# Altium schematic sheet POWER.SchDoc
size A3; ApprovedBy: b; CheckedBy: a; CompanyName: 天津市松正电动汽车技术股份有限公司; DocumentNumber: SZQZ-YL-0035; SheetNumber: 2; SheetTotal: 5; PageSetup: Record=PageOptions|CenterHorizontal=True|CenterVertical=True|PrintScale=0.86|XCorrection=1.00|YCorrection=1.00|PrintKind=1|BorderSize=5000000|LeftOffset=0|BottomOffset=0|Orientation=2|PaperLength=1000|PaperWidth=1000|Scale=100|PaperSource=7|PrintQuality=-4|MediaType=1|DitherType=10|PaperKind=B4|PrintScaleMode=1; ModifiedDate: 2017-3-1
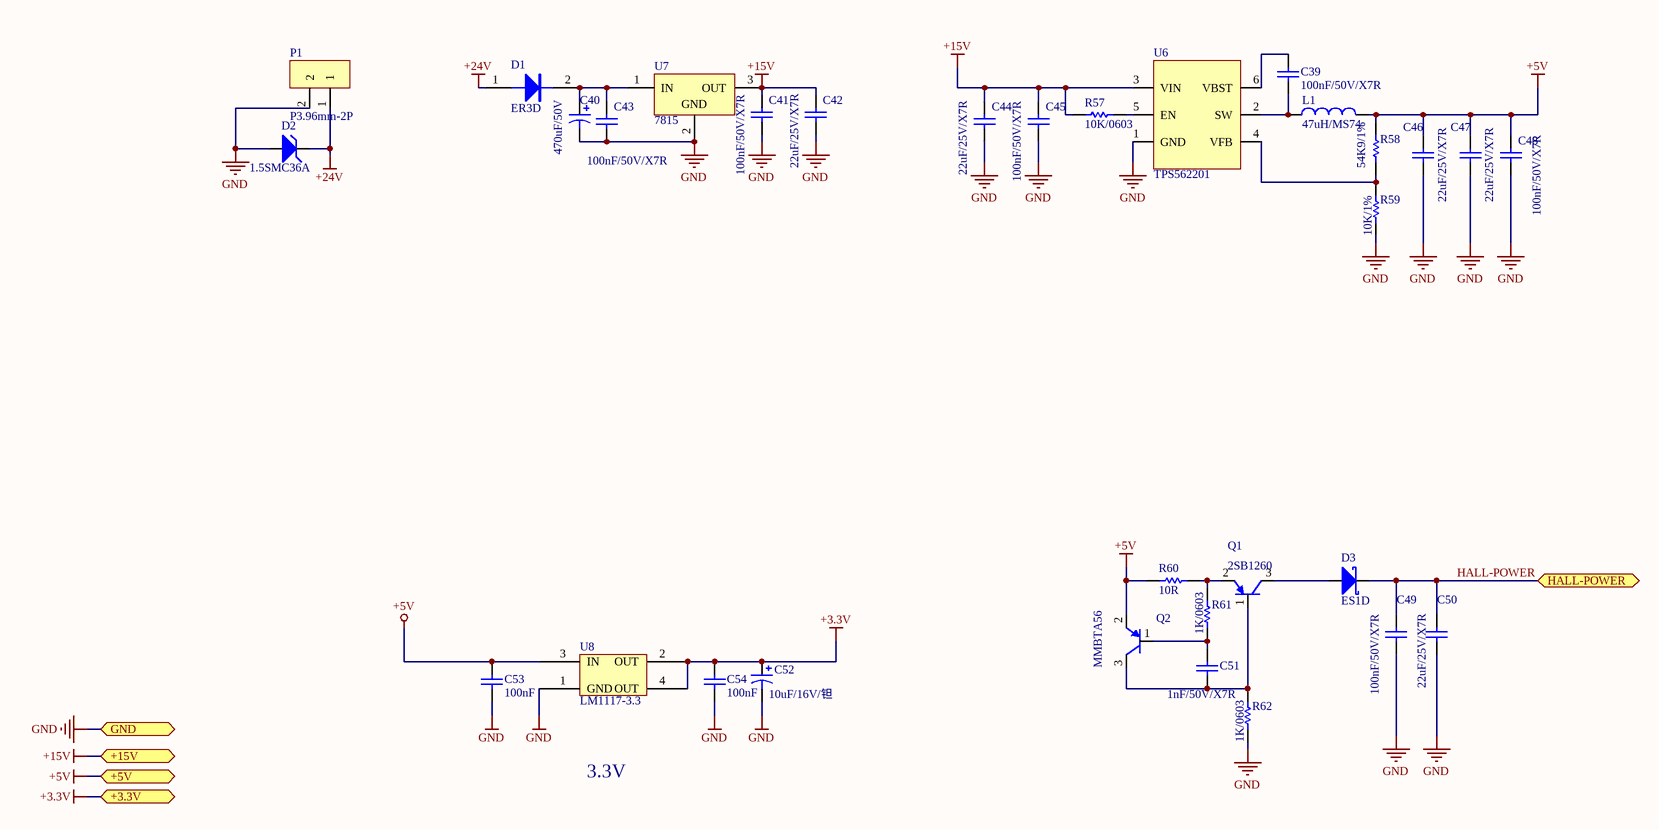
[diagram p0: POWER.SchDoc]

## Parts
C39  100nF/50V/X7R  [c0603]
C40  470uF/50V  [c10X16]
C41  100nF/50V/X7R  [c0603]
C42  22uF/25V/X7R  [1210]
C43  100nF/50V/X7R  [c0603]
C44  22uF/25V/X7R  [1210]
C45  100nF/50V/X7R  [c0603]
C46  22uF/25V/X7R  [1210]
C47  22uF/25V/X7R  [1210]
C48  100nF/50V/X7R  [c0603]
C49  100nF/50V/X7R  [c0603]
C50  22uF/25V/X7R  [1210]
C51  1nF/50V/X7R  [c0603]
C52  10uF/16V/钽  [SMD3528-B]
C53  100nF  [c0603]
C54  100nF  [c0603]
D1  ER3D  [SMC]
D2  1.5SMC36A  [SMC]
D3  ES1D  [SMA]
L1  47uH/MS74  [L-7.2*7.2*4]
P1  P3.96mm-2P  [P3.96mm-2P]
Q1  2SB1260  [SOT-89]
Q2  MMBTA56  [SOT-23]
R57  10K/0603  [0603]
R58  54K9/1%  [0603]
R59  10K/1%  [0603]
R60  10R  [0805]
R61  1K/0603  [0603]
R62  1K/0603  [0603]
U6  TPS562201  [SOT-23-6]
U7  7815  [D2PAK]
U8  LM1117-3.3  [SOT-223]

## Ports
+3.3V, +5V, +15V, GND, HALL-POWER

## Nets
+3.3V: C52.1 C54.1 U8.2(OUT) U8.4(OUT) ; port +3.3V
+5V: C46.2 C47.2 C48.2 C53.1 L1.2 Q2.2 R58.2 R60.1 U8.3(IN) ; port +5V
+15V: C41.2 C42.2 C44.2 C45.2 R57.1 U6.3(VIN) U7.3(OUT) ; port +15V
+24V: D1.1(A) D2.2(K) P1.1
GND: C40.2 C41.1 C42.1 C43.1 C44.1 C45.1 C46.1 C47.1 C48.1 C49.1 C50.1 C52.2 C53.2 C54.2 D2.1(A) P1.2 R59.1 R62.1 U6.1(GND) U7.2(GND) U8.1(GND) ; port GND
HALL-POWER: C49.2 C50.2 D3.2(K) ; port HALL-POWER
NetC39_1: C39.1 U6.6(VBST)
NetC39_2: C39.2 L1.1 U6.2(SW)
NetC40_1: C40.1 C43.2 D1.2(K) U7.1(IN)
NetC51_1: C51.1 Q1.1 Q2.3 R62.2
NetC51_2: C51.2 Q2.1 R61.1
NetD3_1: D3.1(A) Q1.3
NetQ1_2: Q1.2 R60.2 R61.2
NetR57_2: R57.2 U6.5(EN)
NetR58_1: R58.1 R59.2 U6.4(VFB)

## Notes on the sheet
- 3.3V
- 公司名称
- 文件编号
- 文件名称
- 执行日期
- 设计
- 文件说明
- 批准
- 图纸页码
- 第    页
- 共    页

## Library data of the parts
C39 C41-C51 = Cap: value: 100pF
C40 = cap2: Value: 3.3uF
C52 = cap2: Value: 10uF/16V/钽
C53 C54 = Cap: value: 100nF
D2 = D Zener: Zener Diode; Value: 1SMB5935BT3; Published: 8-Jun-2000; LatestRevisionDate: 17-Jul-2002; LatestRevisionNote: Re-released for DXP Platform.; PackageReference: DIODE-0.7; Publisher: Altium Limited
L1 = L-7.2*7.2*4
Q1 = PNP-SOT89
Q2 = PNP-SOT23
R57-R62 = R: Resistor; value: 1K
U6 = TPS562201: TPS56220x 4.5-V to 17-V Input, 2-A
U7 = MC78FC50HT1: Micropower Ultra-Low Quiescent Current Voltage Regulator; Note: TAB is connected to Pin 2; Published: 15-Apr-2002; DatasheetVersion: 1998; PackageVersion: 1999; PackageReference: 1213-01; Publisher: Altium Limited; PackageDescription: SOT-89; Body 4.6 x 4.25 mm, inc. leads (LxW max); ComponentLink1Description: Manufacturer Link; ComponentLink1URL: http://www.onsemi.com/site/products/taxonomy/0,4438,503,00.html; ComponentLink2Description: Datasheet; ComponentLink2URL: http://www.onsemi.com/pub/Collateral/MC78FC00-D.PDF